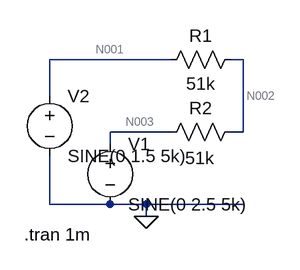
[diagram p0: schematic Draft1.asc]
Draft1.asc, the LTspice schematic file:
Version 4
SHEET 1 880 680
WIRE 128 128 -32 128
WIRE 224 128 208 128
WIRE -32 176 -32 128
WIRE 128 224 48 224
WIRE 224 224 224 128
WIRE 224 224 208 224
WIRE 48 240 48 224
WIRE -32 320 -32 256
WIRE 48 320 -32 320
WIRE 96 320 48 320
WIRE 224 320 96 320
WIRE 96 336 96 320
FLAG 96 336 0
SYMBOL res 224 112 R90
WINDOW 0 0 56 VBottom 2
WINDOW 3 32 56 VTop 2
SYMATTR InstName R1
SYMATTR Value 51k
SYMBOL res 224 208 R90
WINDOW 0 0 56 VBottom 2
WINDOW 3 35 57 VTop 2
SYMATTR InstName R2
SYMATTR Value 51k
SYMBOL voltage 48 224 R0
WINDOW 123 0 0 Left 2
WINDOW 39 0 0 Left 2
SYMATTR InstName V1
SYMATTR Value SINE(0 2.5 5k)
SYMBOL voltage -32 160 R0
WINDOW 123 0 0 Left 2
WINDOW 39 0 0 Left 2
SYMATTR InstName V2
SYMATTR Value SINE(0 1.5 5k)
TEXT -66 360 Left 2 !.tran 1m

The netlist it stands for:
* Draft1.asc
R1 N002 N001 51k
R2 N002 N003 51k
V1 N003 0 SINE(0 2.5 5k)
V2 N001 0 SINE(0 1.5 5k)
.tran 1m
.backanno
.end

* Results of the author's LTspice run, read from the files saved beside the schematic
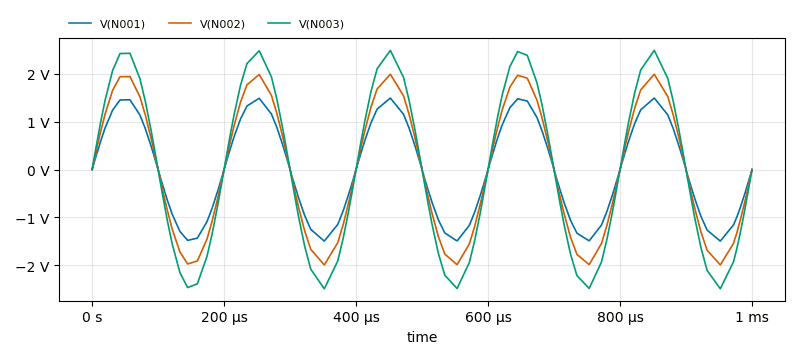
[diagram p1: Transient Analysis of Draft1.asc, plotted from the saved traces]
* Transient Analysis, 1 run:
*   V(N001): min -1.496 V, max 1.496 V, average 512.9 µV, rms 1.044 V, last 0 V
*   V(N002): min -1.994 V, max 1.994 V, average 683.8 µV, rms 1.393 V, last 0 V
*   V(N003): min -2.493 V, max 2.493 V, average 854.8 µV, rms 1.741 V, last 0 V